# EAGLE design bluetooth-v12 (EAGLE 6.2)
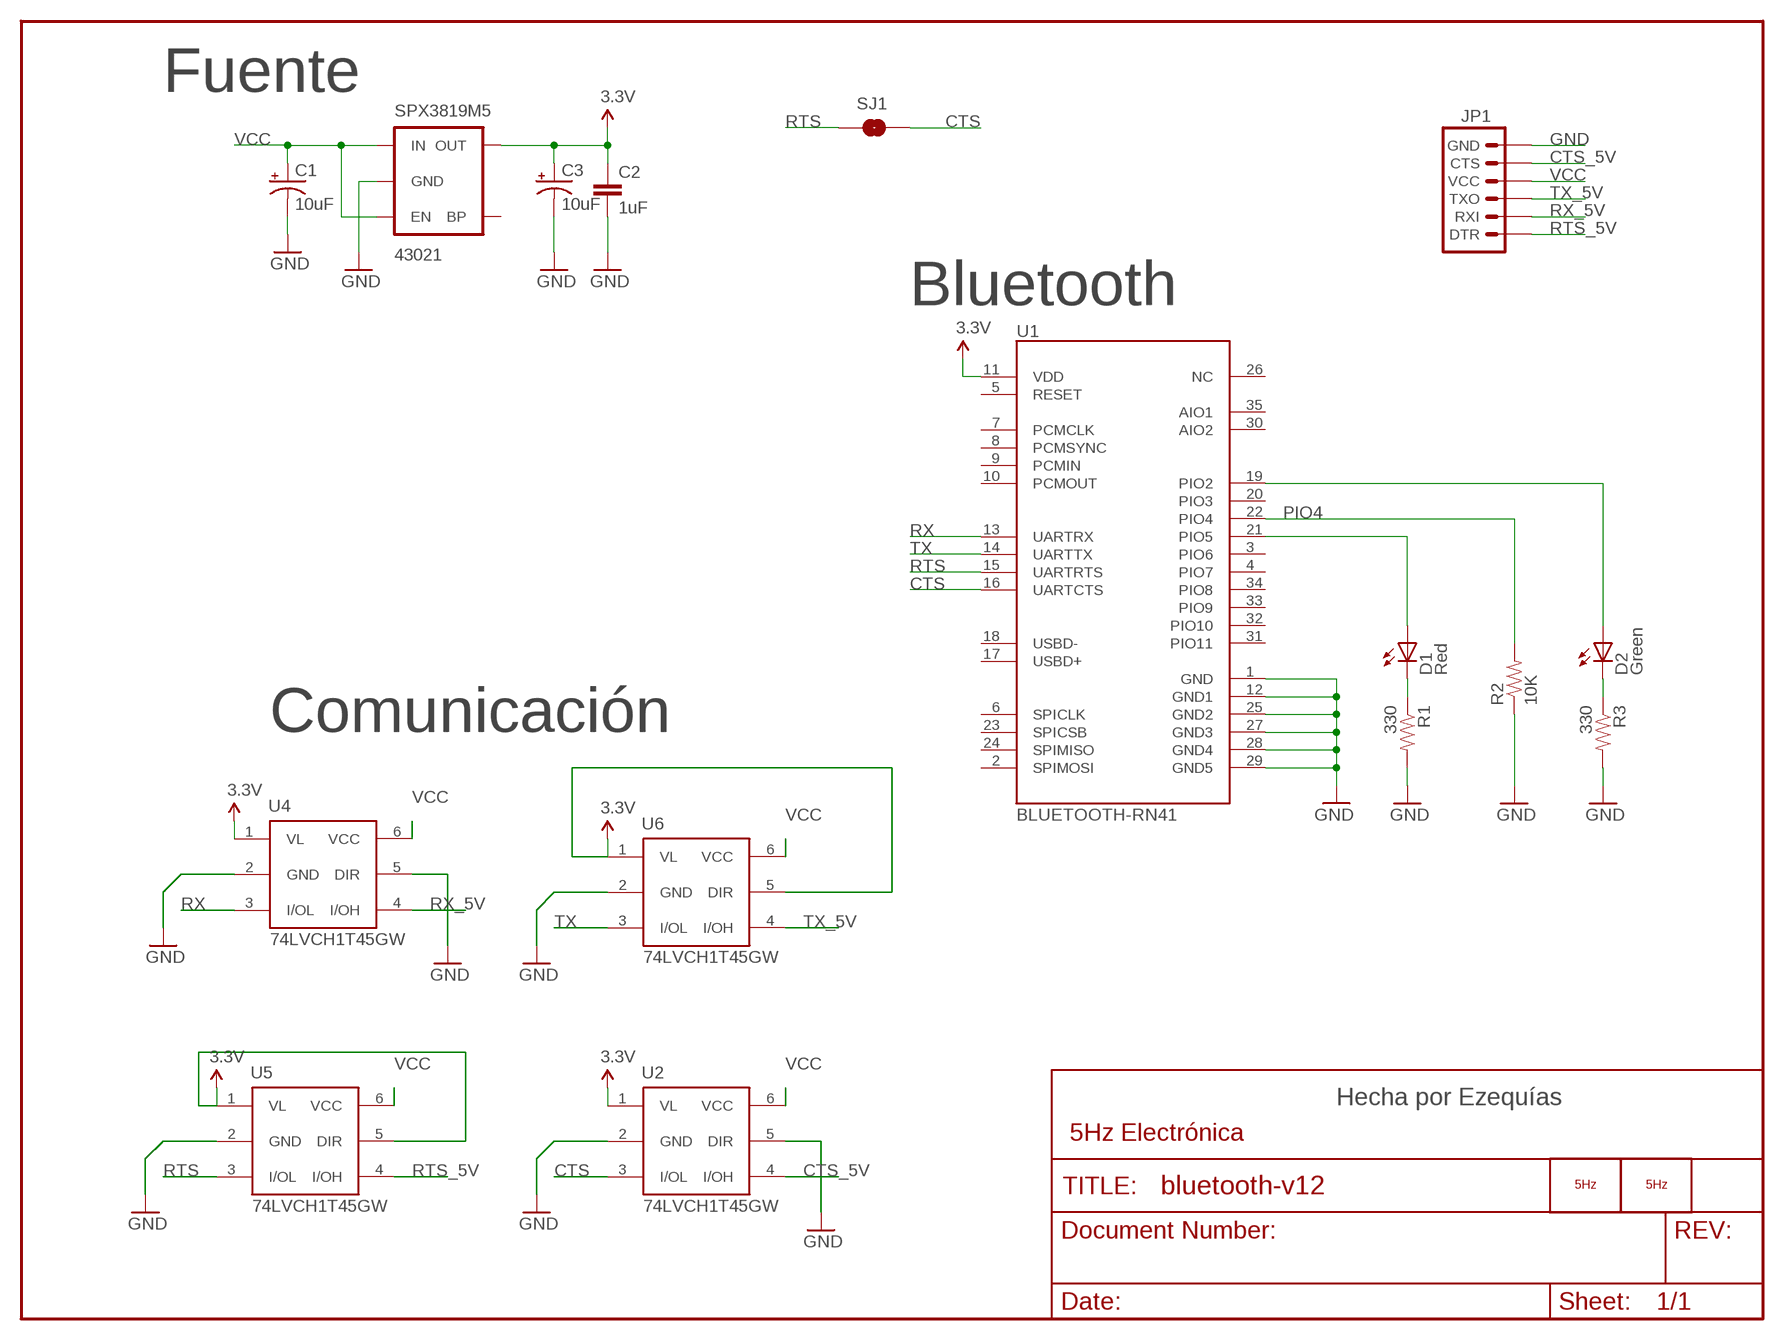
[diagram p0: schematic, sheet 1]

## Parts
C1  10uF  CAP_POL1206  [EIA3216]
C2  1uF  CAP0603-CAP  [0603-CAP]
C3  10uF  CAP_POL1206  [EIA3216]
D1  Red  LED0603  [LED-0603]
D2  Green  LED0603  [LED-0603]
JP1  ARDUINO_SERIAL_PROGRAMPTH  [1X06]
LOGO2  LOGO_5HZ_H_5MM  [5HZ_LOGO_H_5MM]
LOGO3  LOGO_5HZ_H_15MM  [5HZ_LOGO_H_15MM]
R1  330  RESISTOR0603-RES  [0603-RES]
R2  10K  RESISTOR0603-RES  [0603-RES]
R3  330  RESISTOR0603-RES  [0603-RES]
SJ1  SOLDERJUMPERNO  [SJ_2S-NO]
SPX3819M5  43021  V_REG_LDOSMD  [SOT23-5]
U1  BLUETOOTH-RN41  BLUETOOTH-RN41"  [RN41]
U2  74LVCH1T45GW  [SOT-363]
U4  74LVCH1T45GW  [SOT-363]
U5  74LVCH1T45GW  [SOT-363]
U6  74LVCH1T45GW  [SOT-363]

## Nets
3.3V: C2.1 C3.A(+) SPX3819M5.5(OUT) U1.11(VDD) U2.1(VL) U4.1(VL) U5.1(VL) U5.5(DIR) U6.1(VL) U6.5(DIR)
CTS: SJ1.2 U1.16(UARTCTS) U2.3(I/OL)
CTS_5V: JP1.5(CTS) U2.4(I/OH)
D1: D1.C R1.1
D2: D2.C R3.1
GND: C1.C(-) C2.2 C3.C(-) JP1.6(GND) R1.2 R2.1 R3.2 SPX3819M5.2(GND) U1.1(GND) U1.12(GND1) U1.25(GND2) U1.27(GND3) U1.28(GND4) U1.29(GND5) U2.2(GND) U2.5(DIR) U4.2(GND) U4.5(DIR) U5.2(GND) U6.2(GND)
N$1: D1.A U1.21(PIO5)
N$2: D2.A U1.19(PIO2)
PIO4: R2.2 U1.22(PIO4)
RTS: SJ1.1 U1.15(UARTRTS) U5.3(I/OL)
RTS_5V: JP1.1(DTR) U5.4(I/OH)
RX: U1.13(UARTRX) U4.3(I/OL)
RX_5V: JP1.2(RXI) U4.4(I/OH)
TX: U1.14(UARTTX) U6.3(I/OL)
TX_5V: JP1.3(TXO) U6.4(I/OH)
VCC: C1.A(+) JP1.4(VCC) SPX3819M5.1(IN) SPX3819M5.3(EN) U2.6(VCC) U4.6(VCC) U5.6(VCC) U6.6(VCC)
Unconnected: SPX3819M5.4(BP) U1.2(SPIMOSI) U1.3(PIO6) U1.4(PIO7) U1.5(RESET) U1.6(SPICLK) U1.7(PCMCLK) U1.8(PCMSYNC) U1.9(PCMIN) U1.10(PCMOUT) U1.17(USBD+) U1.18(USBD-) U1.20(PIO3) U1.23(SPICSB) U1.24(SPIMISO) U1.26(NC) U1.30(AIO2) U1.31(PIO11) U1.32(PIO10) U1.33(PIO9) U1.34(PIO8) U1.35(AIO1)

## Notes on the sheet
- Fuente
- Bluetooth
- Comunicación
- Hecha por Ezequías
- 5Hz Electrónica

## Library data of the parts
C1 C3 = SparkFun:CAP_POL: Capacitor Polarized These are standard SMD and PTH capacitors. Normally 10uF, 47uF, and 100uF in electrolytic and tantalum varieties. Always verify the external diameter of the through hole cap, it varies with capacity, voltage, and manufacturer. The EIA devices should be standard.
C2 = SparkFun:CAP: Capacitor Standard 0603 ceramic capacitor, and 0.1" leaded capacitor.
D1 D2 = SparkFun:LED: LEDs Standard schematic elements and footprints for 5mm, 3mm, 1206, and 0603 sized LEDs. 5mm - Spark Fun Electronics SKU : COM-00529 (and others)
JP1 = SparkFun:ARDUINO_SERIAL_PROGRAM
LOGO2 LOGO3 = 5hz-electronica:LOGO_5HZ: Logotipo 5Hz "según Pedro"
R1-R3 = SparkFun:RESISTOR: Resistor Basic schematic elements and footprints for 0603, 1206, and PTH resistors.
SJ1 = SparkFun:SOLDERJUMPER: Solder Jumper Standard SMD solder jumper. Used to automate production. Two varients : Normally Open and Normally Closed are the same, but have different paste layers. NC will have a large amount of paste and should jumper during reflow.
SPX3819M5 = SparkFun:V_REG_LDO: Voltage Regulator LDO Standard 150mA LDO voltage regulator in SOT-23 layout. Micrel part MIC5205. BP (by-pass) pin is used to lower output noise with 470pF cap.
U1 = ScratchPad:BLUETOOTH-RN41
U2 U4-U6 = 74LVCH1T45:74LVCH1T45GW

## Net classes
1 vcc: width 0.254 mm

## Board
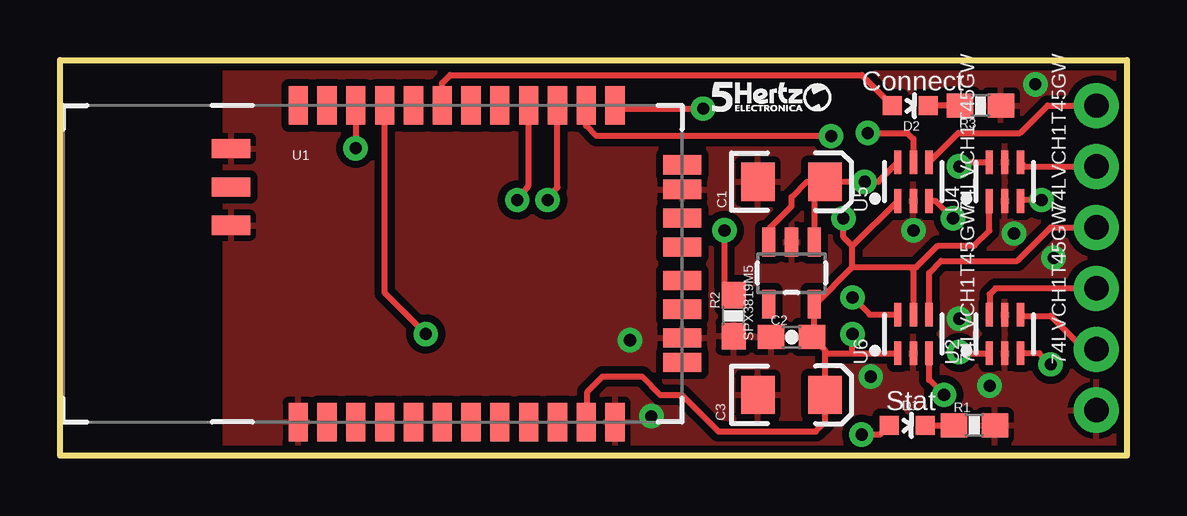
[diagram p1: board, top side]
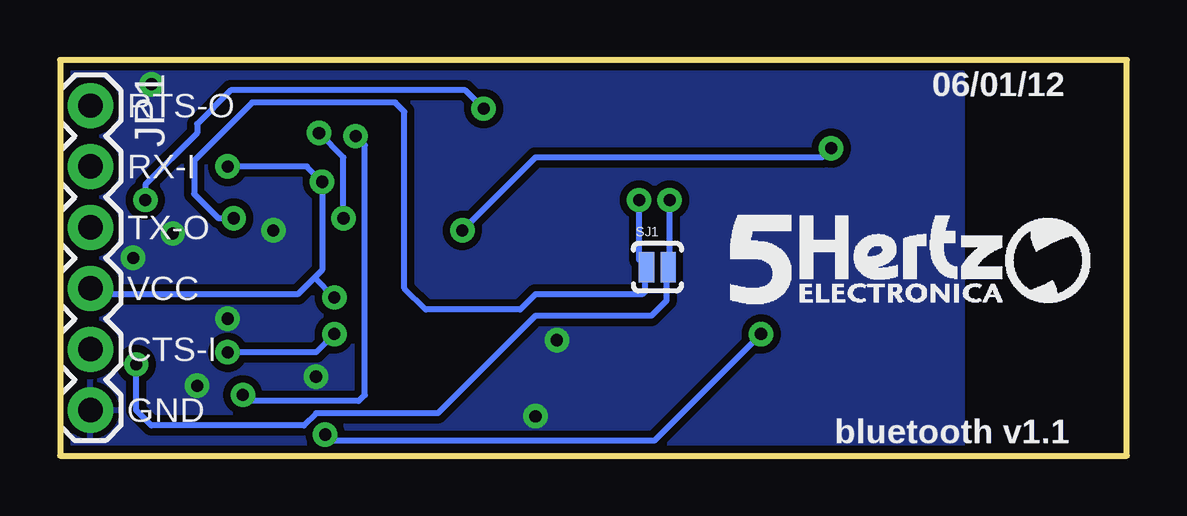
[diagram p2: board, bottom side, seen from below]

Size 44.45 x 16.51 mm. Coordinates in mm from the lower left corner, seen from the top.
Outline: 0,0 0,16.51 44.45,16.51 44.45,0 0,0
Copper layers (1*16): Top 0.035mm / dielectric 1.5mm / Bottom 0.035mm
Design rules: minimum track width 8mil, minimum drill 20mil, track to track 8mil, track to pad 8mil, pad to pad 8mil, via to via 8mil, smd to smd 8mil, copper to edge 10mil, drill to drill 8mil, minimum pad ring 12mil, minimum via ring 10mil, stop-mask expansion 4mil, vias tented up to drill 25mil, thermal gap 10mil

### Footprints (pad centres in the part's own frame; a part is rotated, then mirrored left to right if it is on the bottom)
EIA3216 = smd 1.4 x 1.6: A 1.4,0; C -1.4,0
0603-CAP = smd 1.1 x 1: 1 -0.85,0; 2 0.85,0
LED-0603 = smd 0.8 x 0.8: A 0,-0.75; C 0,0.75
1X06 = drill 1.016 pad 1.88: 1 0,0; 2 2.54,0; 3 5.08,0; 4 7.62,0; 5 10.16,0; 6 12.7,0
0603-RES = smd 1.1 x 1: 1 -0.85,0; 2 0.85,0
SJ_2S-NO = smd 0.635 x 1.27: 1 -0.45,0; 2 0.45,0
SOT23-5 = smd 0.55 x 1.2: 1 -0.95,-1.3; 2 0,-1.3; 3 0.95,-1.3; 4 0.95,1.3; 5 -0.95,1.3
RN41 = smd 0.8 x 1.6: 1 -6.6,-6.6; 2 -5.4,-6.6; 3 -4.2,-6.6; 4 -3,-6.6; 5 -1.8,-6.6; 6 -0.6,-6.6; 7 0.6,-6.6; 8 1.8,-6.6; 9 3,-6.6; 10 4.2,-6.6; 11 5.4,-6.6; 12 6.6,-6.6; 13 6.6,6.6; 14 5.4,6.6; 15 4.2,6.6; 16 3,6.6; 17 1.8,6.6; 18 0.6,6.6; 19 -0.6,6.6; 20 -1.8,6.6; 21 -3,6.6; 22 -4.2,6.6; 23 -5.4,6.6; 24 -6.6,6.6 | smd 1.6 x 0.8: 25 -9.4,4.8; 26 -9.4,3.2; 27 -9.4,1.6; 28 9.4,3.1; 29 9.4,-3.1; 30 9.4,-4.122; 31 9.4,-1.9; 32 9.4,-0.7; 33 9.4,0.7; 34 9.4,1.9; 35 9.4,4.122
SOT-363 = smd 0.3 x 0.99: 1 -0.65,-0.8; 2 0,-0.8; 3 0.65,-0.8; 4 0.65,0.81; 5 0,0.81; 6 -0.65,0.81

### Placement (x,y rotation side)
C1  30.48,11.43 0 top
C2  30.48,4.95 180 top
C3  30.48,2.54 0 top
D1  35.31,1.27 270 top
D2  35.43,14.61 270 top
JP1  43.18,14.61 270 bottom
LOGO2  27.18,14.35 0 top
LOGO3  16.51,6.35 0 bottom
R1  38.1,1.27 0 top
R2  28.07,5.84 90 top
R3  38.35,14.61 0 top
SJ1  19.56,7.87 0 bottom
SPX3819M5  30.48,7.62 180 top
U1  16.53,8.01 0 top
U2  39.37,5.08 0 top
U4  39.37,11.43 0 top
U5  35.56,11.43 0 top
U6  35.56,5.08 0 top

### Tracks (layer width: path | path; a pad name or v marks a point on that pad's centre or on a via)
3.3V  (via drill 0.51)
  Top 0.254: 31.88,4.19 C3.A 31.88,1.4 31.5,1.02 27.43,1.02 25.91,2.54 25.02,2.54 24.26,3.3 22.61,3.3 21.97,2.67 21.97,1.46 U1.11 | 31.88,4.19 31.88,4.4 C2.1 31.43,5.05 SPX3819M5.5 31.47,6.32 33.02,7.87 | 33.02,7.87 33.02,8.74 | 33.02,8.74 U5.1 34.92,10.64 | U4.1 38.72,9.38 38.1,8.76 36.58,8.76 35.69,7.87 35.43,7.87 | 33.02,4.28 31.97,4.28 31.88,4.19 | 33.02,4.28 U6.1 | U2.1 37.5,4.28 v37.47,4.32 | 33.02,4.28 v33.02,5.08 | U6.5 35.56,7.75 35.43,7.87 | U5.5 35.56,13.21 35.31,13.46 v33.66,13.46 | v32.64,9.91 32.64,9.12 33.02,8.74 | 33.02,7.87 35.43,7.87
  Bottom 0.254: v37.47,4.32 33.78,4.32 v33.02,5.08 | v33.66,13.46 32.64,12.45 v32.64,9.91
CTS  (via drill 0.51)
  Top 0.254: U1.16 19.53,11.27 v19.05,10.67 | U2.3 40.8,4.28 v41.27,3.81
  Bottom 0.254: v19.05,10.67 19.05,7.93 SJ1.2 19.18,7.8 19.18,6.48 19.81,5.84 24.64,5.84 28.7,1.78 33.78,1.78 34.29,1.27 40.64,1.27 41.27,1.91 v41.27,3.81
CTS_5V
  Top 0.254: JP1.5 42.67,4.45 41.27,5.84 40.07,5.84 U2.4
D1
  Top 0.254: D1.C R1.1
D2
  Top 0.254: R3.1 D2.C
GND  (via drill 0.51)
  Top 0.254: U1.25 7.01,12.7
  other vias: 24.64,1.65 23.75,4.83 40.64,15.49 38.73,2.92 33.78,3.3 39.75,9.27 37.47,5.71 41.4,8.26 35.56,9.4
  pour Bottom (isolate 0.305): 6.86,0 44.4,0 44.4,16 6.86,16
  pour Top (isolate 0.305): 6.86,0 44.4,0 44.4,16 6.86,16
N$1  (via drill 0.51)
  Top 0.254: U1.21 13.53,6.79 v15.24,5.08 | v33.4,0.89 34.17,0.89 D1.A
  Bottom 0.254: v15.24,5.08 19.68,0.64 33.15,0.64 v33.4,0.89
N$2
  Top 0.254: U1.19 15.93,15.54 16.26,15.88 33.41,15.88 D2.A
PIO4  (via drill 0.51)
  Top 0.254: U1.22 v12.33,12.83 v12.32,12.83 | v27.69,9.4 27.69,7.07 R2.2
  Bottom 0.254: v12.32,12.83 12.7,12.45 24.64,12.45 v27.69,9.4
RTS  (via drill 0.51)
  Top 0.254: U1.15 20.73,11.2 v20.32,10.67 | U5.3 36.49,10.63 v37.21,9.91
  Bottom 0.254: v20.32,10.67 20.32,8.19 SJ1.1 20.07,7.82 20.07,6.86 20.19,6.73 24.64,6.73 25.27,6.1 29.21,6.1 30.1,6.99 30.1,14.35 30.48,14.73 36.45,14.73 38.86,12.32 38.86,10.92 37.85,9.91 v37.21,9.91
RTS_5V
  Top 0.254: JP1.1 41.15,14.61 40.01,13.46 37.43,13.46 U5.4
RX  (via drill 0.51)
  Top 0.254: v40.89,10.67 40.06,10.67 U4.3 | v26.8,14.48 23.26,14.48 U1.13
  Bottom 0.254: v40.89,10.67 40.89,11.3 38.73,13.46 38.73,13.84 37.34,15.24 27.56,15.24 v26.8,14.48
RX_5V
  Top 0.254: JP1.2 40.2,12.06 U4.4
TX  (via drill 0.51)
  Top 0.254: U1.14 21.93,13.76 22.35,13.34 v32.13,13.34 | U6.3 36.21,3.16 v36.83,2.54
  Bottom 0.254: v32.13,13.34 31.75,12.95 31.75,2.54 32,2.29 36.58,2.29 v36.83,2.54
TX_5V
  Top 0.254: U6.4 36.21,7.63 36.7,8.13 39.88,8.13 41.27,9.53 JP1.3
VCC  (via drill 0.51)
  Top 0.254: SPX3819M5.1 31.43,10.98 C1.A | C1.A 31.11,11.43 30.48,10.79 30.48,10.41 29.59,9.53 29.59,8.98 SPX3819M5.3 | JP1.4 38.99,6.99 38.73,6.73 38.73,5.91 U2.6 | C1.A v33.53,11.43 34.1,11.43 U5.6 | U4.6 37.64,12.24 v37.47,12.06 | U6.6 33.73,5.89 v33.02,6.6
  Bottom 0.254: 33.85,7.43 33.53,7.75 v33.53,11.43 34.16,12.06 v37.47,12.06 | 33.85,7.43 34.54,6.73 42.42,6.73 42.67,6.99 JP1.4 | 33.85,7.43 v33.02,6.6

### Text on the board
tPlace: Connect | Stat
bPlace: 06/01/12 | RTS-O | RX-I | TX-O | VCC | CTS-I | bluetooth v1.1 | GND